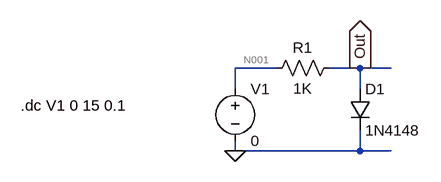
[diagram p0: schematic Silicon Diode.asc]
Silicon Diode.asc, the LTspice schematic file:
Version 4
SHEET 1 880 680
WIRE 128 -800 64 -800
WIRE 256 -800 208 -800
WIRE 304 -800 256 -800
WIRE 64 -768 64 -800
WIRE 256 -768 256 -800
WIRE 64 -672 64 -688
WIRE 256 -672 256 -704
WIRE 256 -672 64 -672
WIRE 304 -672 256 -672
FLAG 64 -672 0
FLAG 256 -800 Out
IOPIN 256 -800 Out
SYMBOL res 224 -816 R90
WINDOW 0 0 56 VBottom 2
WINDOW 3 32 56 VTop 2
SYMATTR InstName R1
SYMATTR Value 1K
SYMATTR SpiceLine tol=1 pwr=0.1
SYMBOL diode 240 -768 R0
SYMATTR InstName D1
SYMATTR Value 1N4148
SYMBOL voltage 64 -784 R0
WINDOW 123 0 0 Left 2
WINDOW 39 0 0 Left 2
SYMATTR InstName V1
SYMATTR Value 0
TEXT -266 -742 Left 2 !.dc V1 0 15 0.1

The netlist it stands for:
* Silicon Diode.asc
R1 Out N001 1K tol=1 pwr=0.1
D1 Out 0 1N4148
V1 N001 0 0
.model D D
.lib standard.dio
.dc V1 0 15 0.1
.backanno
.end

* Results of the author's LTspice run, read from the files saved beside the schematic
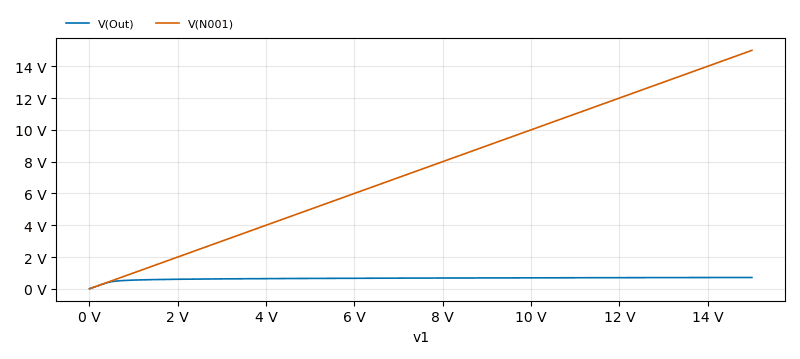
[diagram p1: DC transfer characteristic of Silicon Diode.asc, plotted from the saved traces]
* DC transfer characteristic, 1 run:
*   V(Out): 0 V at v1=0 V, 712.8 mV at v1=15 V, min 0 V, max 712.8 mV
*   V(N001): 0 V at v1=0 V, 15 V at v1=15 V, min 0 V, max 15 V